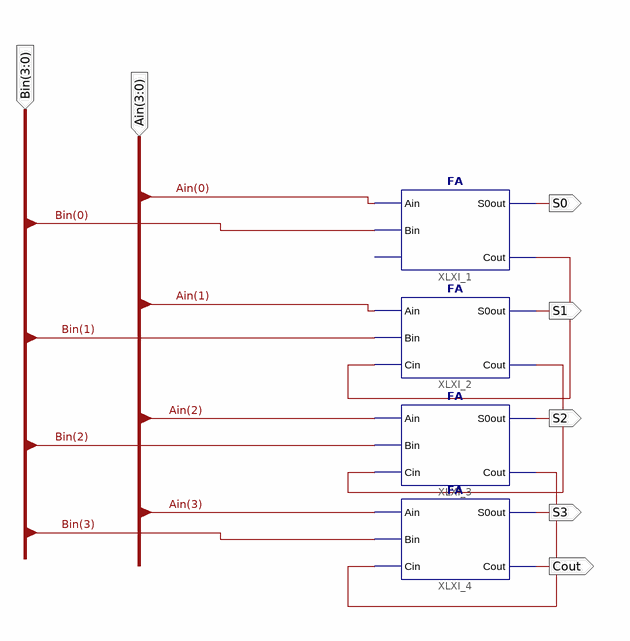
[diagram p0: schematic sheet 1]
// Xilinx ISE schematic Lab5_Exp1.sch (spartan3e) as structural Verilog: 4 symbols, 7 ports
module Lab5_Exp1 (
  input  [3:0] Ain,
  input  [3:0] Bin,
  output S0,
  output S1,
  output S2,
  output S3,
  output Cout
);

  wire XLXN_6, XLXN_7, XLXN_8;

  FA XLXI_1 (.Ain(Ain[0]), .Bin(Bin[0]), .S0out(S0), .Cout(XLXN_6));  // open: Cin
  FA XLXI_2 (.Ain(Ain[1]), .Bin(Bin[1]), .Cin(XLXN_6), .S0out(S1), .Cout(XLXN_7));
  FA XLXI_3 (.Ain(Ain[2]), .Bin(Bin[2]), .Cin(XLXN_7), .S0out(S2), .Cout(XLXN_8));
  FA XLXI_4 (.Ain(Ain[3]), .Bin(Bin[3]), .Cin(XLXN_8), .S0out(S3), .Cout(Cout));
endmodule
